# EAGLE schematic Remote Input Circuitry (EAGLE 9.0.1)

## Sheet 1 of 3
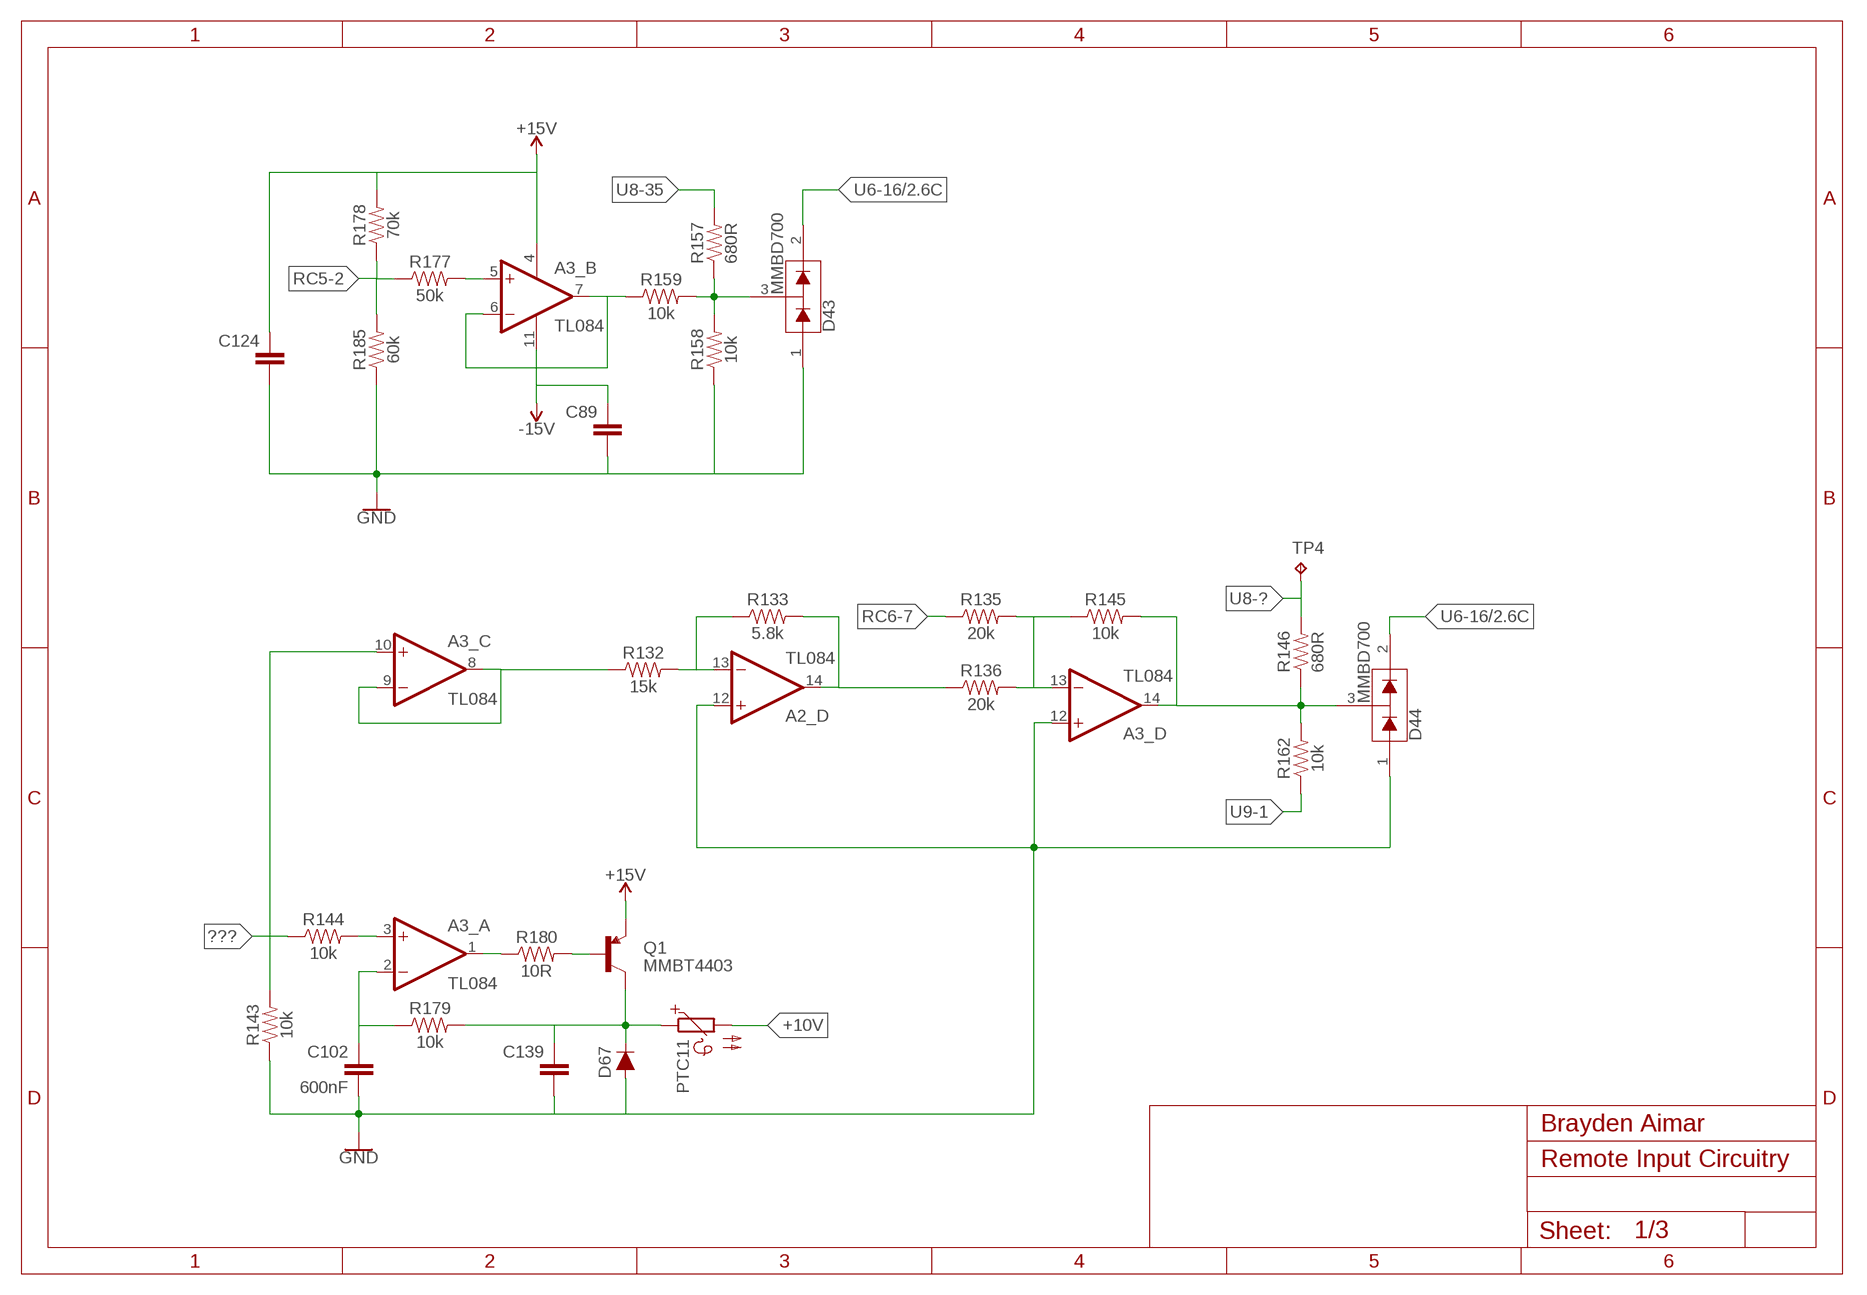
[diagram p0: schematic, sheet 1]

### Parts
A2_  TL084  MC33079D  [SO14]
A3_  TL084  MC33079D  [SO14]
C89  C-EUC0402  [C0402]
C102  600nF  C-EUC0402  [C0402]
C124  C-EUC0402  [C0402]
C139  C-EUC0402  [C0402]
D43  MMBD700  BAV99  [SOT23-3]
D44  MMBD700  BAV99  [SOT23-3]
D67  DIODE-BAS16J  [SOD-323]
PTC11  PTC660A  [P660A]
Q1  MMBT4403  TRANSISTOR_PNPMMBT4403  [SOT23-3]
R132  15k  RESISTOR0603  [0603]
R133  5.8k  RESISTOR0603  [0603]
R135  20k  RESISTOR0603  [0603]
R136  20k  RESISTOR0603  [0603]
R143  10k  RESISTOR0603  [0603]
R144  10k  RESISTOR0603  [0603]
R145  10k  RESISTOR0603  [0603]
R146  680R  RESISTOR0603  [0603]
R157  680R  RESISTOR0603  [0603]
R158  10k  RESISTOR0603  [0603]
R159  10k  RESISTOR0603  [0603]
R162  10k  RESISTOR0603  [0603]
R177  50k  RESISTOR0603  [0603]
R178  70k  RESISTOR0603  [0603]
R179  10k  RESISTOR0603  [0603]
R180  10R  RESISTOR0603  [0603]
R185  60k  RESISTOR0603  [0603]
TP4  TPB1,27  [B1,27]

### Nets
+10V: PTC11.2
-15V: A3_.11(P:V-) C89.1
???: A3_.10(C:+IN) R143.2 R144.1
GND: A2_.12(D:+IN) A3_.12(D:+IN) C89.2 C102.2 C124.2 C139.2 D43.1(A1) D44.1(A1) D67.A R143.1 R158.1 R185.1 ; also sheet 2,3
N$1: A3_.6(B:-IN) A3_.7(B:OUT) R159.1
N$2: A2_.13(D:-IN) R132.2 R133.1
N$3: D43.3(COM) R157.1 R158.2 R159.2
N$4: A3_.8(C:OUT) A3_.9(C:-IN) R132.1
N$5: A3_.2(A:-IN) C102.1 R179.1
N$6: A3_.1(A:OUT) R180.1
N$7: A3_.5(B:+IN) R177.2
N$8: Q1.1(B) R180.2
N$9: A3_.3(A:+IN) R144.2
N$10: C139.1 D67.C PTC11.1 Q1.3(C) R179.2
N$11: A2_.14(D:OUT) R133.2 R136.1
N$14: A3_.13(D:-IN) R135.2 R136.2 R145.1
N$15: A3_.14(D:OUT) D44.3(COM) R145.2 R146.1 R162.2
RC5-2: R177.1 R178.1 R185.2
RC6-7: R135.1
U6-16: D43.2(C2) D44.2(C2) ; also sheet 2
U8-35: R157.2
U8-?: R146.2 TP4.TP
U9-1: R162.1
VCC: A3_.4(P:V+) C124.1 Q1.2(E) R178.2 ; supply symbol labelled +15V ; also sheet 2

### Notes on the sheet
- Brayden Aimar

## Sheet 2 of 3
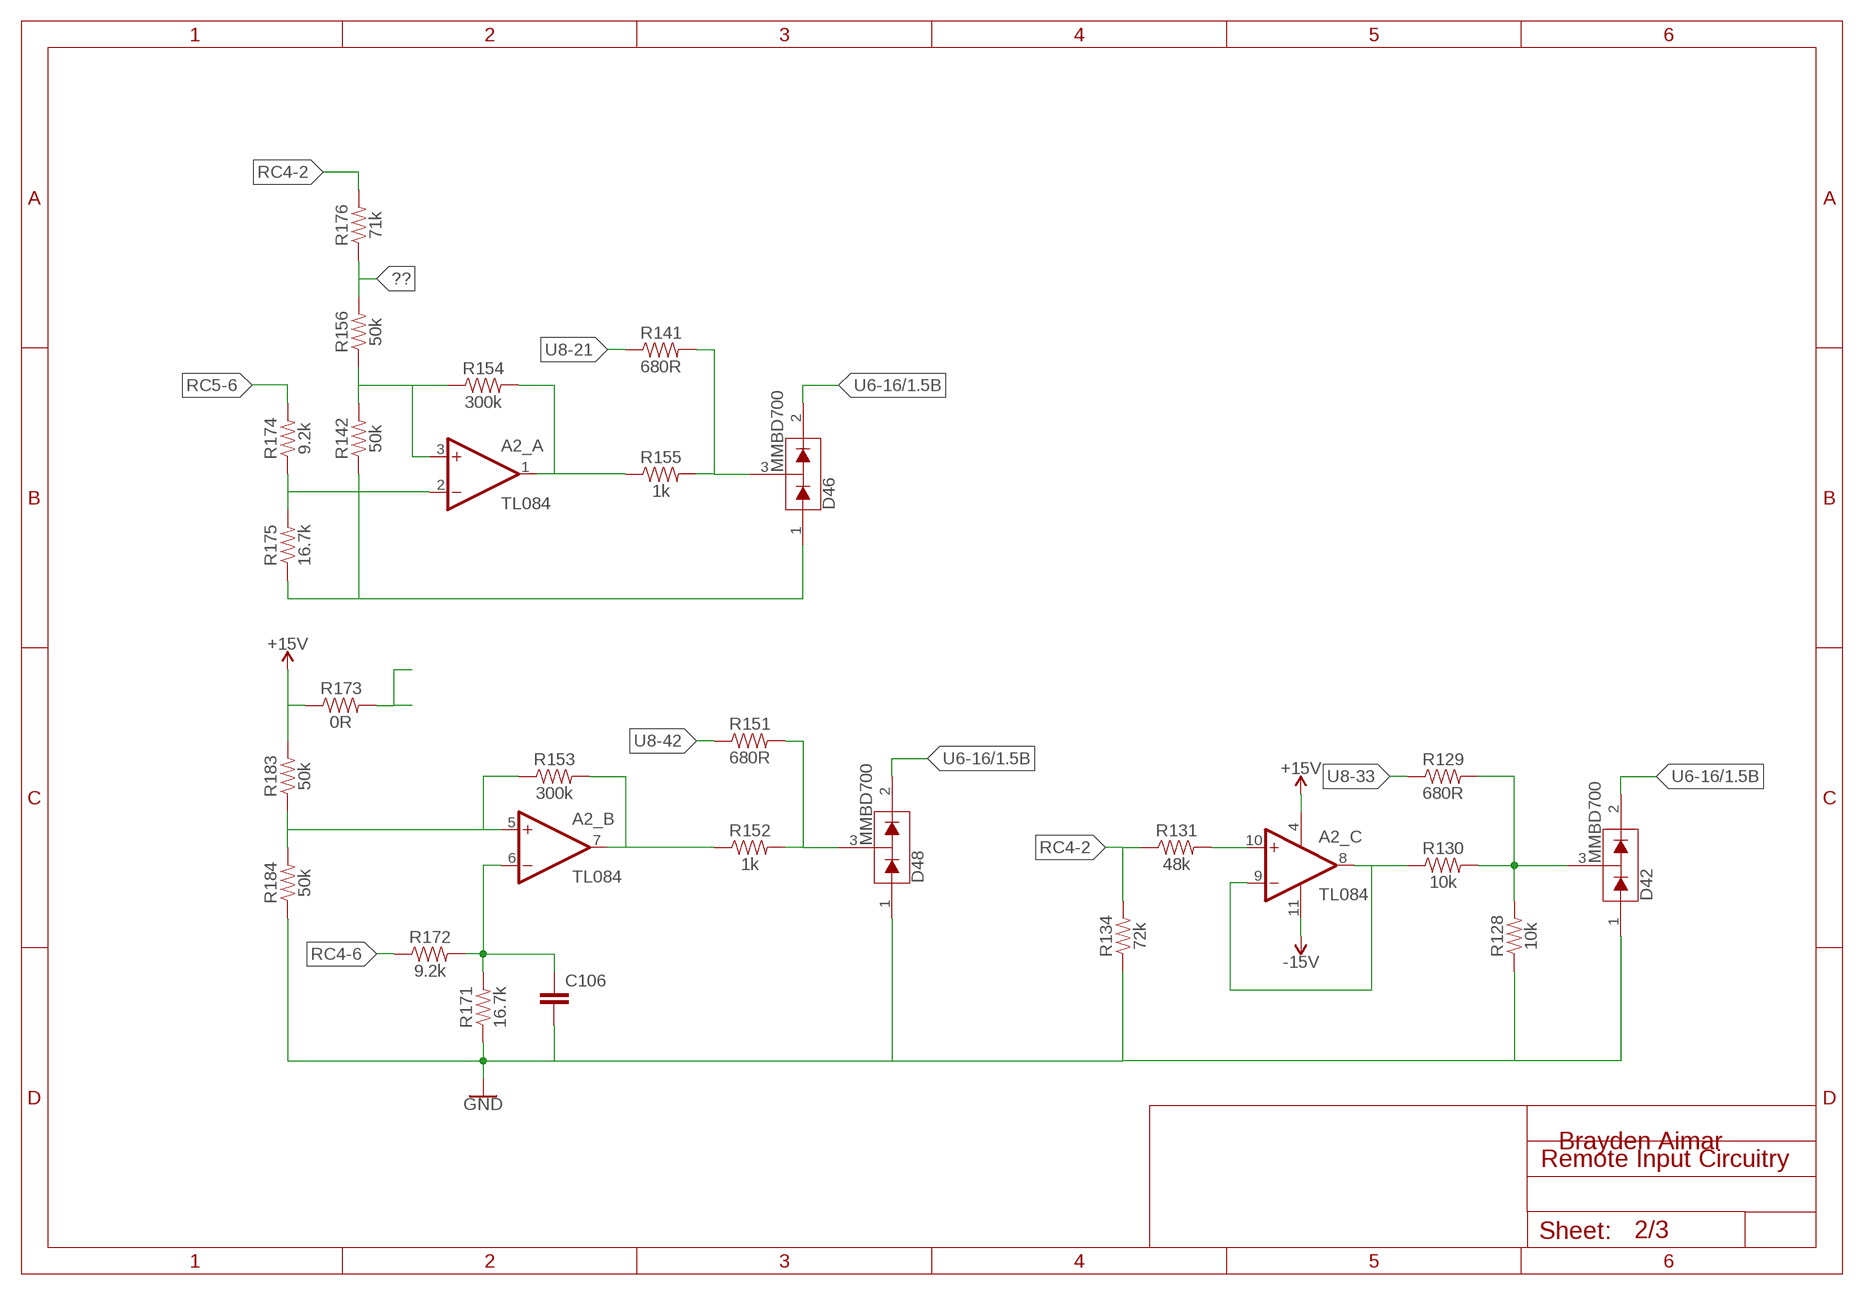
[diagram p1: schematic, sheet 2]

### Parts
C106  0.1UF-0603-25V-(+80/-20%)  [0603]
D42  MMBD700  BAV99  [SOT23-3]
D46  MMBD700  BAV99  [SOT23-3]
D48  MMBD700  BAV99  [SOT23-3]
R128  10k  RESISTOR0603  [0603]
R129  680R  RESISTOR0603  [0603]
R130  10k  RESISTOR0603  [0603]
R131  48k  RESISTOR0603  [0603]
R134  72k  RESISTOR0603  [0603]
R141  680R  RESISTOR0603  [0603]
R142  50k  RESISTOR0603  [0603]
R151  680R  RESISTOR0603  [0603]
R152  1k  RESISTOR0603  [0603]
R153  300k  RESISTOR0603  [0603]
R154  300k  RESISTOR0603  [0603]
R155  1k  RESISTOR0603  [0603]
R156  50k  RESISTOR0603  [0603]
R171  16.7k  RESISTOR0603  [0603]
R172  9.2k  RESISTOR0603  [0603]
R173  0R  RESISTOR0603  [0603]
R174  9.2k  RESISTOR0603  [0603]
R175  16.7k  RESISTOR0603  [0603]
R176  71k  RESISTOR0603  [0603]
R183  50k  RESISTOR0603  [0603]
R184  50k  RESISTOR0603  [0603]

### Nets
??: R156.2 R176.1
GND: C106.2 D42.1(A1) D48.1(A1) R128.1 R134.1 R171.1 R184.1 ; also sheet 1,3
N$12: A2_.3(A:+IN) R142.2 R154.1 R156.1
N$13: A2_.8(C:OUT) A2_.9(C:-IN) R130.1
N$16: A2_.2(A:-IN) R174.1 R175.2
N$17: A2_.1(A:OUT) R154.2 R155.1
N$18: D48.3(COM) R151.2 R152.2
N$19: D46.1(A1) R142.1 R175.1
N$20: D46.3(COM) R141.2 R155.2
N$21: A2_.7(B:OUT) R152.1 R153.2
N$22: R173.2
N$23: A2_.5(B:+IN) R153.1 R183.1 R184.2
N$24: A2_.6(B:-IN) C106.1 R171.2 R172.2
N$25: D42.3(COM) R128.2 R129.2 R130.2
N$31: A2_.10(C:+IN) R131.2
RC4-2: R131.1 R134.2 R176.2
RC4-6: R172.1
RC5-6: R174.2
U6-16: D42.2(C2) D46.2(C2) D48.2(C2) ; also sheet 1
U8-21: R141.1
U8-33: R129.1
U8-42: R151.1
VCC: A2_.4(P:V+) R173.1 R183.2 ; supply symbol labelled +15V ; also sheet 1
VNEG: A2_.11(P:V-) ; supply symbol labelled -15V

### Notes on the sheet
- Brayden Aimar

## Sheet 3 of 3
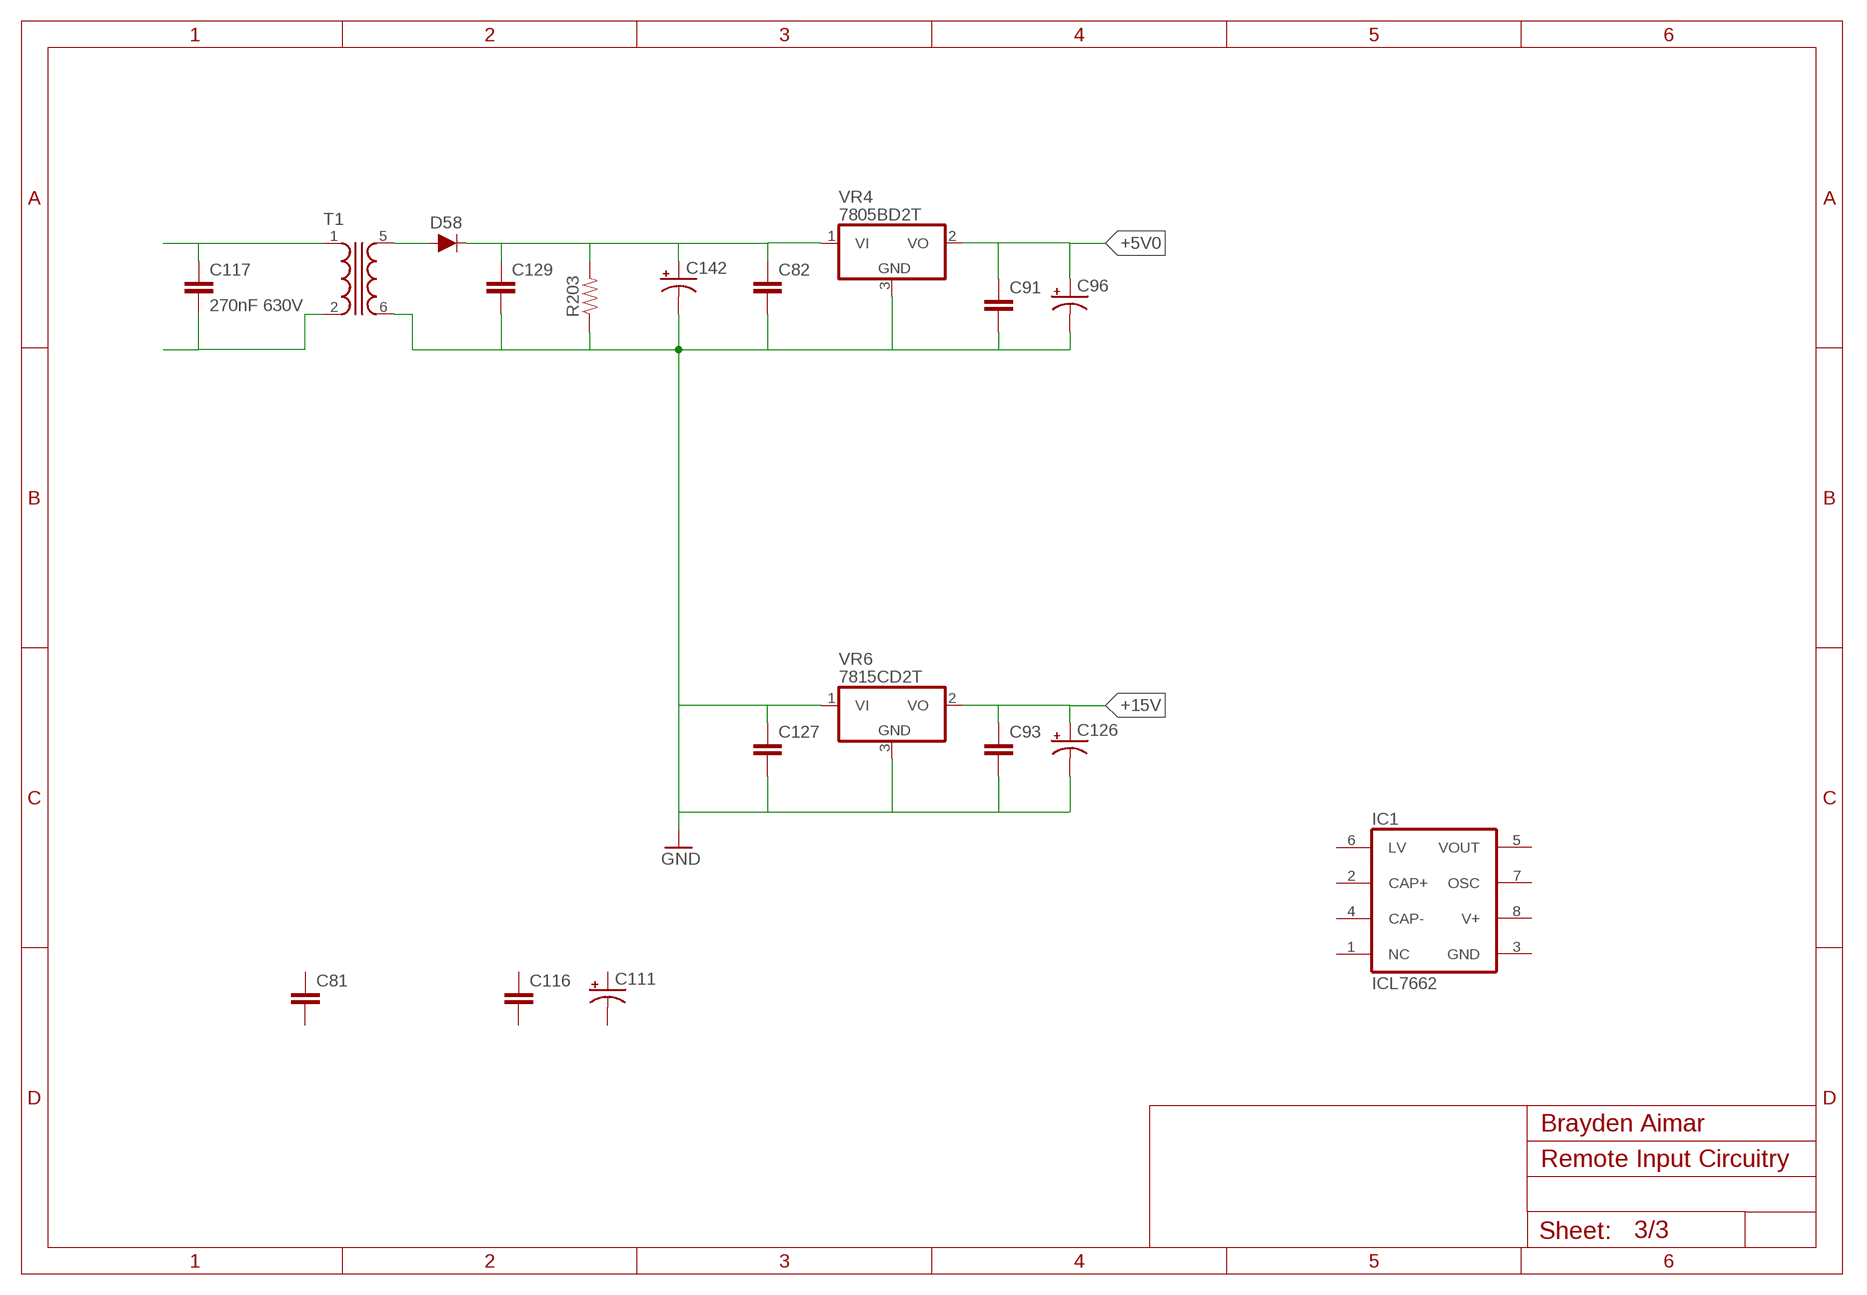
[diagram p2: schematic, sheet 3]

### Parts
C81  0.1UF-0603-25V-(+80/-20%)  [0603]
C82  0.1UF-0603-25V-(+80/-20%)  [0603]
C91  0.1UF-0603-25V-(+80/-20%)  [0603]
C93  0.1UF-0603-25V-(+80/-20%)  [0603]
C96  10UF-POLAR-RADIAL-2.5MM-25V-20%  [CPOL-RADIAL-2.5MM-5MM]
C111  10UF-POLAR-RADIAL-2.5MM-25V-20%  [CPOL-RADIAL-2.5MM-5MM]
C116  0.1UF-0603-25V-(+80/-20%)  [0603]
C117  270nF 630V  0.1UF-0603-25V-(+80/-20%)  [0603]
C126  10UF-POLAR-RADIAL-2.5MM-25V-20%  [CPOL-RADIAL-2.5MM-5MM]
C127  0.1UF-0603-25V-(+80/-20%)  [0603]
C129  0.1UF-0603-25V-(+80/-20%)  [0603]
C142  10UF-POLAR-RADIAL-2.5MM-25V-20%  [CPOL-RADIAL-2.5MM-5MM]
D58  DIODE-BAS16J  [SOD-323]
IC1  ICL7662  ICL7660CSA  [SO08]
R203  RESISTOR0603  [0603]
T1  XFORMER  [T70-E]
VR4  7805BD2T  7824DT  [TO252]
VR6  7815CD2T  7824DT  [TO252]

### Nets
+5V0: C91.1 C96.1(+) VR4.2(VO)
+15V: C93.1 C126.1(+) VR6.2(VO)
GND: C82.2 C91.2 C93.2 C96.2(-) C126.2(-) C127.1 C127.2 C129.2 C142.2(-) R203.1 T1.6(S2) VR4.3(GND) VR6.1(VI) VR6.3(GND) ; also sheet 1,2
N$26: C82.1 C129.1 C142.1(+) D58.C R203.2 VR4.1(VI)
N$28: D58.A T1.5(S1)
N$32: C117.2 T1.2
N$33: C117.1 T1.1
Unconnected: C81.1 C81.2 C111.1(+) C111.2(-) C116.1 C116.2 IC1.1(NC) IC1.2(CAP+) IC1.4(CAP-) IC1.5(VOUT) IC1.6(LV) IC1.7(OSC) T1.3(P1) T1.4(P2) T1.7(S1) T1.8(S2)

### Notes on the sheet
- Brayden Aimar

## Power pins joined to a net without a drawn wire
GND: IC1.3(GND)
V+: IC1.8(V+)

## Library data of the parts
A2_ A3_ = linear:MC33079: OP AMP
C81 C82 C91 C93 C106 C116 C117 C127 C129 = SparkFun-Capacitors:0.1UF: 0.1µF ceramic capacitors A capacitor is a passive two-terminal electrical component used to store electrical energy temporarily in an electric field.; PROD_ID: CAP-00810; VALUE: 0.1uF
C89 C102 C124 C139 = rcl:C-EU: CAPACITOR, European symbol; SPICEPREFIX: C
C96 C111 C126 C142 = SparkFun-Capacitors:10UF-POLAR: 10.0µF polarized capacitors A capacitor is a passive two-terminal electrical component used to store electrical energy temporarily in an electric field.; PROD_ID: CAP-08440; VALUE: 10uF
D42-D44 D46 D48 = SparkFun-DiscreteSemi:BAV99: Series-pair diode array Two small signal silicon diodes connected anode to cathode. Connections to all three nodes available. Link to datasheet <https://www.fairchildsemi.com/datasheets/BA/BAV99.pdf> SparkFun Products: SparkFun AutoDriver <https://www.sparkfun.com/products/13752>; PROD_ID: DIO-10647; VALUE: 200mA/70V
D58 D67 = SparkFun-DiscreteSemi:DIODE: Diode These are standard reverse protection diodes and small signal diodes. SparkFun Products: SparkFun SparkPunk Sound Kit <https://www.sparkfun.com/products/11177> SparkFun ESP8266 Thing <https://www.sparkfun.com/products/13231>; PROD_ID: DIO-09646; VALUE: 250mA/100V
IC1 = maxim:ICL7660CSA: VOLTAGE CONVERTER; MF: MAXIM; MPN: ICL7660CSA; OC_FARNELL: 9724710; OC_NEWARK: 34C3732
PTC11 = ptc-ntc:PTC660A: PHILIPS PTC; OC_FARNELL: unknown; OC_NEWARK: unknown
Q1 = User-Submitted:TRANSISTOR_PNP: Generic PNP BJT Double check pinouts against datasheets- not all devices are the same! MMBT3906 - 40V 200mA SOT-23 (TRANS-08052) MMBT4403 - 40V 600mA SOT-23 (TRANS-09245); PROD_ID: TRANS-09245
R128-R136 R141-R143 R145 R146 R151-R159 R162 R171-R180 R183 R184 R203 = SparkFun-Resistors:RESISTOR: Generic Resistor Package
R144 R185 = SparkFun-Resistors:RESISTOR: Generic Resistor Package; SPICEPREFIX: R
T1 = special:XFORMER: TRANSFORMER 2 x primary, 2 x secondary
TP4 = testpad:TP: Test pad
VR4 VR6 = linear:78*: Positive VOLTAGE REGULATOR Source: http://cache.national.com/ds/LM/LM78L05.pdf http://www.fairchildsemi.com/ds/LM/LM7805.pdf